# Altium schematic sheet 20p Connector.SchDoc
size Letter
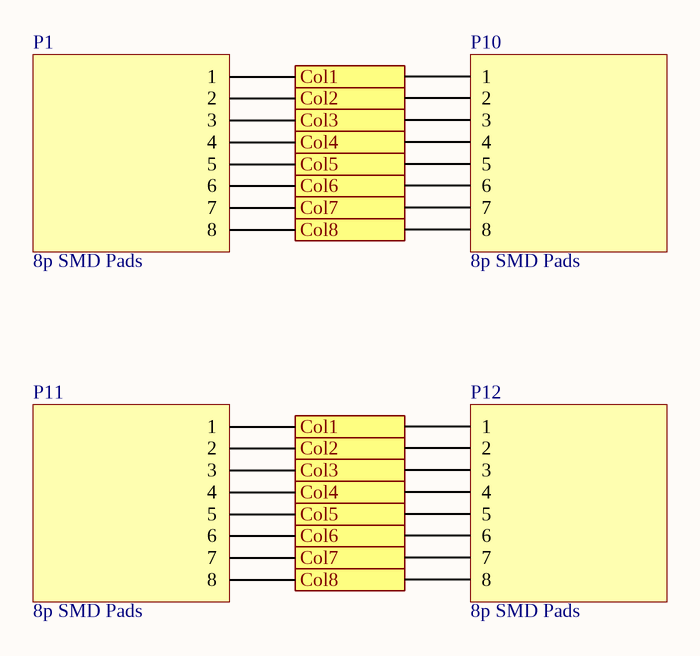
[diagram p0: 20p Connector.SchDoc]

## Parts
P1  8p SMD Pads  [8p SMD pad]
P10  8p SMD Pads  [8p SMD pad]
P11  8p SMD Pads  [8p SMD pad]
P12  8p SMD Pads  [8p SMD pad]

## Ports
Col1, Col2, Col3, Col4, Col5, Col6, Col7, Col8

## Nets
Col1: P1.1 P10.1 P11.1 P12.1 ; port Col1
Col2: P1.2 P10.2 P11.2 P12.2 ; port Col2
Col3: P1.3 P10.3 P11.3 P12.3 ; port Col3
Col4: P1.4 P10.4 P11.4 P12.4 ; port Col4
Col5: P1.5 P10.5 P11.5 P12.5 ; port Col5
Col6: P1.6 P10.6 P11.6 P12.6 ; port Col6
Col7: P1.7 P10.7 P11.7 P12.7 ; port Col7
Col8: P1.8 P10.8 P11.8 P12.8 ; port Col8

## Notes on the sheet
- Title
- Size:
- Date:
- Letter
- Number:
- Time:
- Revision:
- Sheet
- of
- Copyright 2019
- Specialized Solutions LLC
- 206 W Lincoln Hwy STE B
- New Haven, IN 46774
- www.specsolns.com <http://www.specsolns.com>
- File: